# Altium schematic sheet HSMC.SchDoc: Wired Leaf DAQ Interface
size B; Date: 8/10/2012; ApprovedBy: Bryan Newbold; CompanyName: LeafLabs; DrawnBy: David McCoy; Engineer: David McCoy; Organization: LeafLabs; DocumentNumber: 12; Revision: D; SheetNumber: 12; SheetTotal: 22; ProjectPrettyName: Wired Leaf
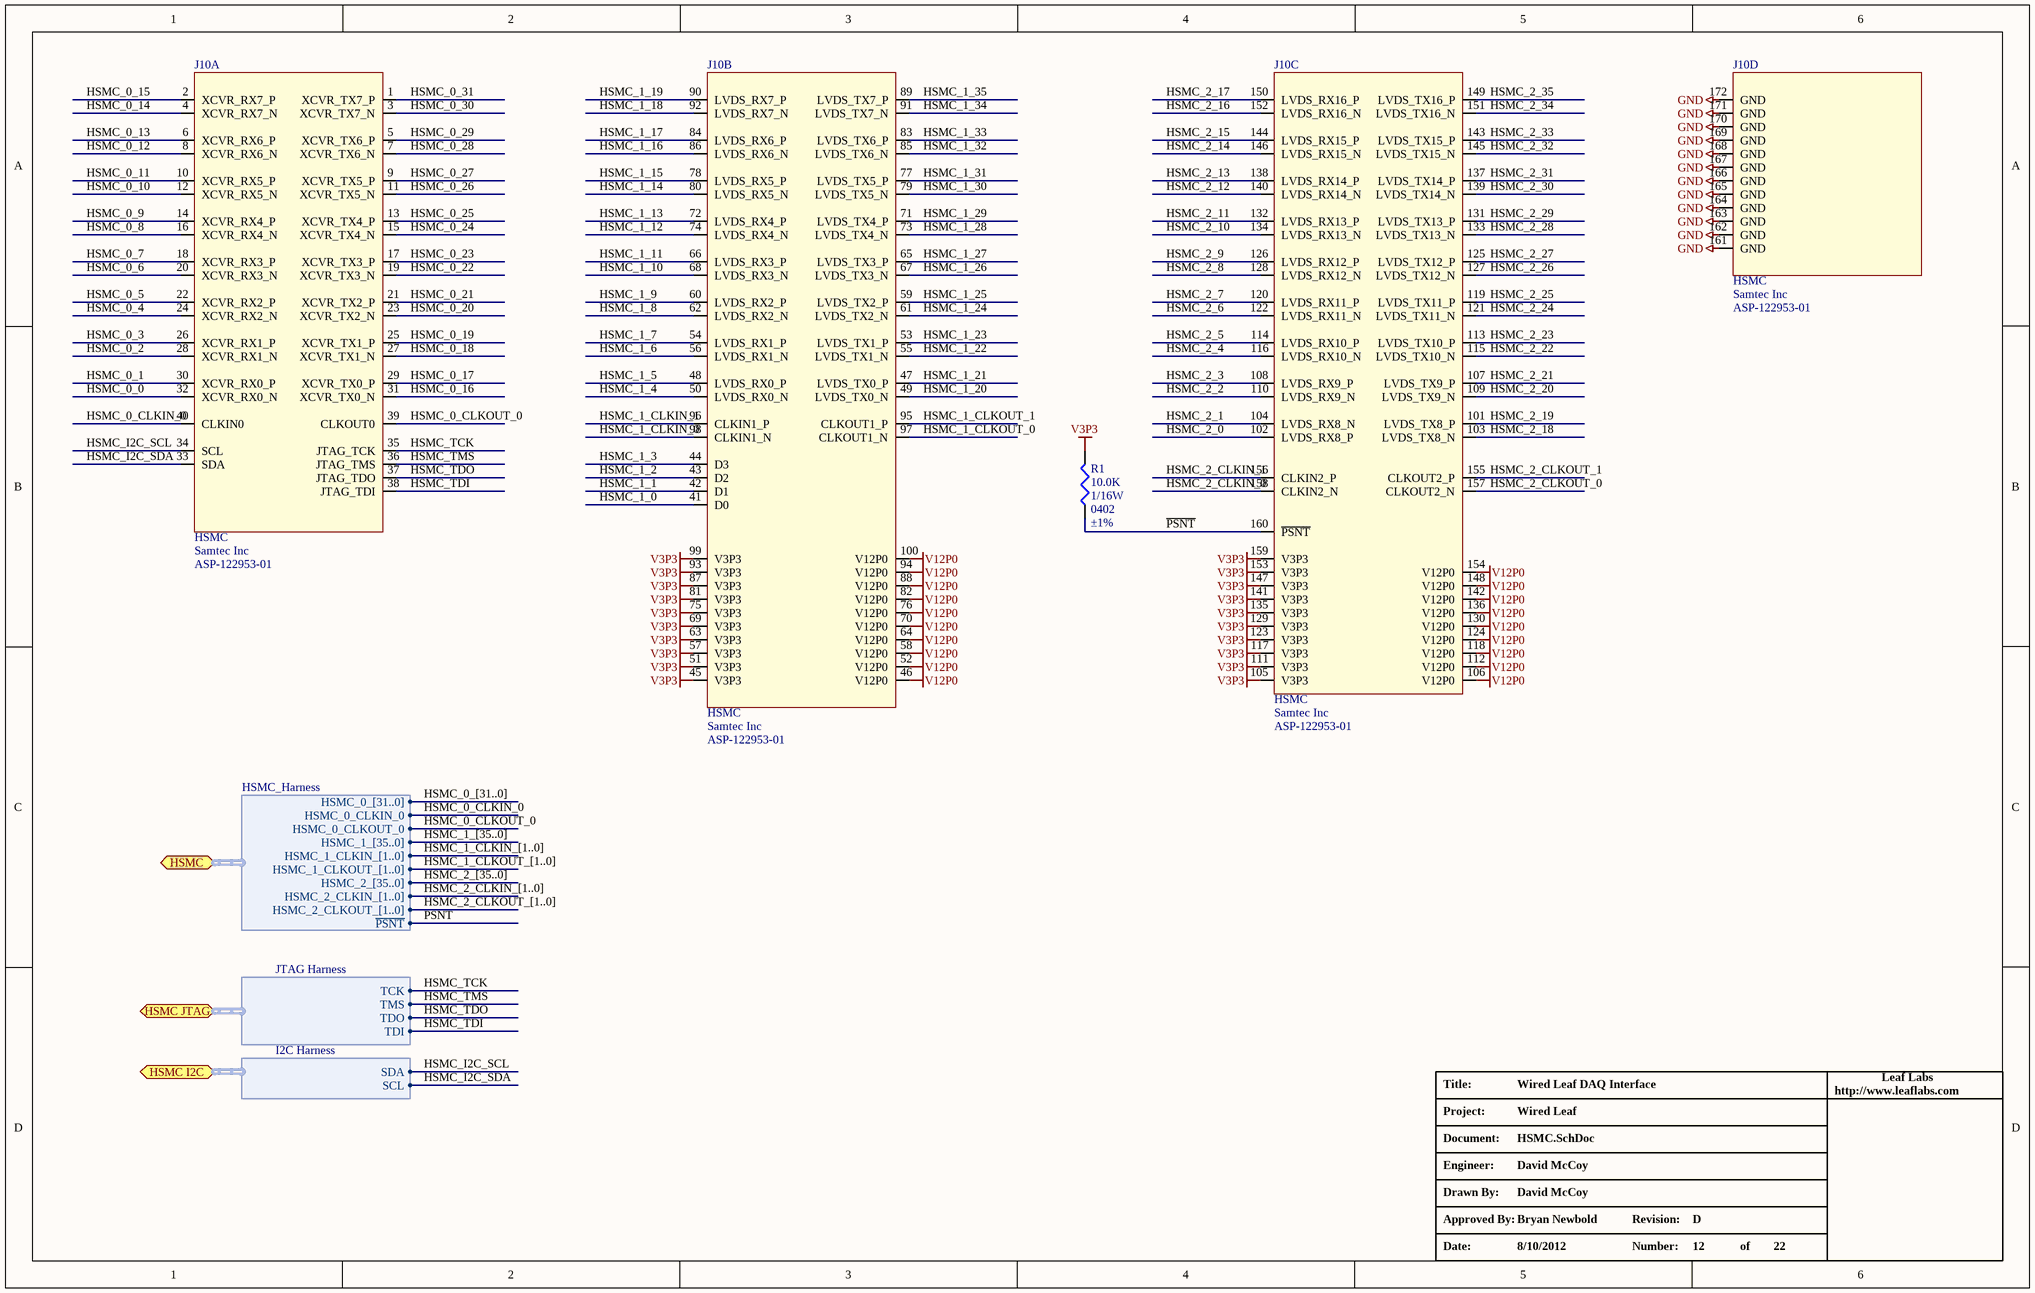
[diagram p0: HSMC.SchDoc]

## Parts
J10  HSMC  Manufacturer: Samtec Inc  Manufacturer Part Number: ASP-122953-01  [ASP-122953-01-ND]  (parts A,B,C,D of 4)
R1  Resistance In Ohms: 10.0K  Power (Watts): 1/16W  Case: 0402  Tolerance: ±1%  [R_0402]  (hidden comment: R_0402_10.0K)

## Ports
HSMC (harness HSMC_Harness), HSMC I2C (harness I2C Harness), HSMC JTAG (harness JTAG Harness)

## Harnesses
HSMC_Harness: HSMC_0_[31..0], HSMC_1_[35..0], HSMC_1_CLKIN_[1..0], HSMC_1_CLKOUT_[1..0], HSMC_2_[35..0], HSMC_2_CLKIN_[1..0], HSMC_2_CLKOUT_[1..0], ~{PSNT}, HSMC_0_CLKIN_0, HSMC_0_CLKOUT_0
JTAG Harness: TCK, TMS, TDO, TDI
I2C Harness: SDA, SCL

## Nets
GND: J10.161(GND) J10.162(GND) J10.163(GND) J10.164(GND) J10.165(GND) J10.166(GND) J10.167(GND) J10.168(GND) J10.169(GND) J10.170(GND) J10.171(GND) J10.172(GND)
V3P3: J10.45(V3P3) J10.51(V3P3) J10.57(V3P3) J10.63(V3P3) J10.69(V3P3) J10.75(V3P3) J10.81(V3P3) J10.87(V3P3) J10.93(V3P3) J10.99(V3P3) J10.105(V3P3) J10.111(V3P3) J10.117(V3P3) J10.123(V3P3) J10.129(V3P3) J10.135(V3P3) J10.141(V3P3) J10.147(V3P3) J10.153(V3P3) J10.159(V3P3) R1.1
V12P0: J10.46(V12P0) J10.52(V12P0) J10.58(V12P0) J10.64(V12P0) J10.70(V12P0) J10.76(V12P0) J10.82(V12P0) J10.88(V12P0) J10.94(V12P0) J10.100(V12P0) J10.106(V12P0) J10.112(V12P0) J10.118(V12P0) J10.124(V12P0) J10.130(V12P0) J10.136(V12P0) J10.142(V12P0) J10.148(V12P0) J10.154(V12P0)
HSMC_0_0: J10.32(XCVR_RX0_N)
HSMC_0_1: J10.30(XCVR_RX0_P)
HSMC_0_2: J10.28(XCVR_RX1_N)
HSMC_0_3: J10.26(XCVR_RX1_P)
HSMC_0_4: J10.24(XCVR_RX2_N)
HSMC_0_5: J10.22(XCVR_RX2_P)
HSMC_0_6: J10.20(XCVR_RX3_N)
HSMC_0_7: J10.18(XCVR_RX3_P)
HSMC_0_8: J10.16(XCVR_RX4_N)
HSMC_0_9: J10.14(XCVR_RX4_P)
HSMC_0_10: J10.12(XCVR_RX5_N)
HSMC_0_11: J10.10(XCVR_RX5_P)
HSMC_0_12: J10.8(XCVR_RX6_N)
HSMC_0_13: J10.6(XCVR_RX6_P)
HSMC_0_14: J10.4(XCVR_RX7_N)
HSMC_0_15: J10.2(XCVR_RX7_P)
HSMC_0_16: J10.31(XCVR_TX0_N)
HSMC_0_17: J10.29(XCVR_TX0_P)
HSMC_0_18: J10.27(XCVR_TX1_N)
HSMC_0_19: J10.25(XCVR_TX1_P)
HSMC_0_20: J10.23(XCVR_TX2_N)
HSMC_0_21: J10.21(XCVR_TX2_P)
HSMC_0_22: J10.19(XCVR_TX3_N)
HSMC_0_23: J10.17(XCVR_TX3_P)
HSMC_0_24: J10.15(XCVR_TX4_N)
HSMC_0_25: J10.13(XCVR_TX4_P)
HSMC_0_26: J10.11(XCVR_TX5_N)
HSMC_0_27: J10.9(XCVR_TX5_P)
HSMC_0_28: J10.7(XCVR_TX6_N)
HSMC_0_29: J10.5(XCVR_TX6_P)
HSMC_0_30: J10.3(XCVR_TX7_N)
HSMC_0_31: J10.1(XCVR_TX7_P)
HSMC_0_CLKIN_0: J10.40(CLKIN0) ; port HSMC.HSMC_0_CLKIN_0
HSMC_0_CLKOUT_0: J10.39(CLKOUT0) ; port HSMC.HSMC_0_CLKOUT_0
HSMC_1_0: J10.41(D0)
HSMC_1_1: J10.42(D1)
HSMC_1_2: J10.43(D2)
HSMC_1_3: J10.44(D3)
HSMC_1_4: J10.50(LVDS_RX0_N)
HSMC_1_5: J10.48(LVDS_RX0_P)
HSMC_1_6: J10.56(LVDS_RX1_N)
HSMC_1_7: J10.54(LVDS_RX1_P)
HSMC_1_8: J10.62(LVDS_RX2_N)
HSMC_1_9: J10.60(LVDS_RX2_P)
HSMC_1_10: J10.68(LVDS_RX3_N)
HSMC_1_11: J10.66(LVDS_RX3_P)
HSMC_1_12: J10.74(LVDS_RX4_N)
HSMC_1_13: J10.72(LVDS_RX4_P)
HSMC_1_14: J10.80(LVDS_RX5_N)
HSMC_1_15: J10.78(LVDS_RX5_P)
HSMC_1_16: J10.86(LVDS_RX6_N)
HSMC_1_17: J10.84(LVDS_RX6_P)
HSMC_1_18: J10.92(LVDS_RX7_N)
HSMC_1_19: J10.90(LVDS_RX7_P)
HSMC_1_20: J10.49(LVDS_TX0_N)
HSMC_1_21: J10.47(LVDS_TX0_P)
HSMC_1_22: J10.55(LVDS_TX1_N)
HSMC_1_23: J10.53(LVDS_TX1_P)
HSMC_1_24: J10.61(LVDS_TX2_N)
HSMC_1_25: J10.59(LVDS_TX2_P)
HSMC_1_26: J10.67(LVDS_TX3_N)
HSMC_1_27: J10.65(LVDS_TX3_P)
HSMC_1_28: J10.73(LVDS_TX4_N)
HSMC_1_29: J10.71(LVDS_TX4_P)
HSMC_1_30: J10.79(LVDS_TX5_N)
HSMC_1_31: J10.77(LVDS_TX5_P)
HSMC_1_32: J10.85(LVDS_TX6_N)
HSMC_1_33: J10.83(LVDS_TX6_P)
HSMC_1_34: J10.91(LVDS_TX7_N)
HSMC_1_35: J10.89(LVDS_TX7_P)
HSMC_1_CLKIN_0: J10.98(CLKIN1_N)
HSMC_1_CLKIN_1: J10.96(CLKIN1_P)
HSMC_1_CLKOUT_0: J10.97(CLKOUT1_N)
HSMC_1_CLKOUT_1: J10.95(CLKOUT1_P)
HSMC_2_0: J10.102(LVDS_RX8_P)
HSMC_2_1: J10.104(LVDS_RX8_N)
HSMC_2_2: J10.110(LVDS_RX9_N)
HSMC_2_3: J10.108(LVDS_RX9_P)
HSMC_2_4: J10.116(LVDS_RX10_N)
HSMC_2_5: J10.114(LVDS_RX10_P)
HSMC_2_6: J10.122(LVDS_RX11_N)
HSMC_2_7: J10.120(LVDS_RX11_P)
HSMC_2_8: J10.128(LVDS_RX12_N)
HSMC_2_9: J10.126(LVDS_RX12_P)
HSMC_2_10: J10.134(LVDS_RX13_N)
HSMC_2_11: J10.132(LVDS_RX13_P)
HSMC_2_12: J10.140(LVDS_RX14_N)
HSMC_2_13: J10.138(LVDS_RX14_P)
HSMC_2_14: J10.146(LVDS_RX15_N)
HSMC_2_15: J10.144(LVDS_RX15_P)
HSMC_2_16: J10.152(LVDS_RX16_N)
HSMC_2_17: J10.150(LVDS_RX16_P)
HSMC_2_18: J10.103(LVDS_TX8_N)
HSMC_2_19: J10.101(LVDS_TX8_P)
HSMC_2_20: J10.109(LVDS_TX9_N)
HSMC_2_21: J10.107(LVDS_TX9_P)
HSMC_2_22: J10.115(LVDS_TX10_N)
HSMC_2_23: J10.113(LVDS_TX10_P)
HSMC_2_24: J10.121(LVDS_TX11_N)
HSMC_2_25: J10.119(LVDS_TX11_P)
HSMC_2_26: J10.127(LVDS_TX12_N)
HSMC_2_27: J10.125(LVDS_TX12_P)
HSMC_2_28: J10.133(LVDS_TX13_N)
HSMC_2_29: J10.131(LVDS_TX13_P)
HSMC_2_30: J10.139(LVDS_TX14_N)
HSMC_2_31: J10.137(LVDS_TX14_P)
HSMC_2_32: J10.145(LVDS_TX15_N)
HSMC_2_33: J10.143(LVDS_TX15_P)
HSMC_2_34: J10.151(LVDS_TX16_N)
HSMC_2_35: J10.149(LVDS_TX16_P)
HSMC_2_CLKIN_0: J10.158(CLKIN2_N)
HSMC_2_CLKIN_1: J10.156(CLKIN2_P)
HSMC_2_CLKOUT_0: J10.157(CLKOUT2_N)
HSMC_2_CLKOUT_1: J10.155(CLKOUT2_P)
HSMC_I2C_SCL: J10.34(SCL) ; port HSMC I2C.SDA
HSMC_I2C_SDA: J10.33(SDA) ; port HSMC I2C.SCL
HSMC_TCK: J10.35(JTAG_TCK) ; port HSMC JTAG.TCK
HSMC_TDI: J10.38(JTAG_TDI) ; port HSMC JTAG.TDI
HSMC_TDO: J10.37(JTAG_TDO) ; port HSMC JTAG.TDO
HSMC_TMS: J10.36(JTAG_TMS) ; port HSMC JTAG.TMS
~{PSNT}: J10.160(~{PSNT}) R1.2 ; port HSMC.~{PSNT}

## Buses and harness runs
bus HSMC_0_[31..0]
bus HSMC_1_[35..0]
bus HSMC_1_CLKIN_[1..0]
bus HSMC_1_CLKOUT_[1..0]
bus HSMC_2_[35..0]
bus HSMC_2_CLKIN_[1..0]
bus HSMC_2_CLKOUT_[1..0]

## Notes on the sheet
- Title:
- http://www.leaflabs.com
- Leaf Labs
- Project:
- Document:
- Engineer:
- Drawn By:
- Approved By:
- Revision:
- Date:
- Number:
- of

## Library data of the parts
J10 = J_HSMC: CONN RECPT 60POS .020" SMT GOLD; Connector Type: Receptacle, Center Strip Contacts; Number of Positions: 80; Pitch: 0.020" (0.50mm); Supplier 1: Digi-Key; Supplier Part Number 1: ASP-122953-01-ND; RoHS: RoHS Compliant; Category: Connectors, Interconnects; Stock 1: 8; Pricing: 1=11.98, 10=9.214, 100=7.7227, 500=7.1901 (USD); Number of Rows: 2; Mounting Type: Surface Mount; Features: Board Guide, Ground Bus (Plane); Contact Finish: Gold; Contact Finish Thickness: Flash; Packaging: Bulk; Mated Stacking Heights: -; Height Above Board: 0.128" (3.25mm); ComponentLink1URL: http://www.samtec.com/Documents/WebFiles/Cpdf/ASP-122953-01.pdf; ComponentLink1Description: http://www.samtec.com/Documents/WebFiles/Cpdf/ASP-122953-01.pdf
R1 = R_0402_10.0K: RES 10.0K OHM 1/16W 1% 0402 SMD; Manufacturer: Vishay/Dale; Manufacturer Part Number: CRCW040210K0FKED; Temperature Coefficient: ±100ppm/°C; Supplier 1: Digi-Key; Supplier Part Number 1: 541-10.0KLDKR-ND; RoHS: RoHS Compliant; Category: Resistors; Stock 1: 669600; Pricing: 10=0.083, 50=0.0444, 200=0.0255, 1000=0.0174 (USD); Composition: Thick Film; Features: -; Lead Style: Surface Mount (SMD - SMT); Packaging: Digi-Reel®; ComponentLink1URL: http://www.vishay.com/doc?20035; ComponentLink1Description: http://www.vishay.com/doc?20035